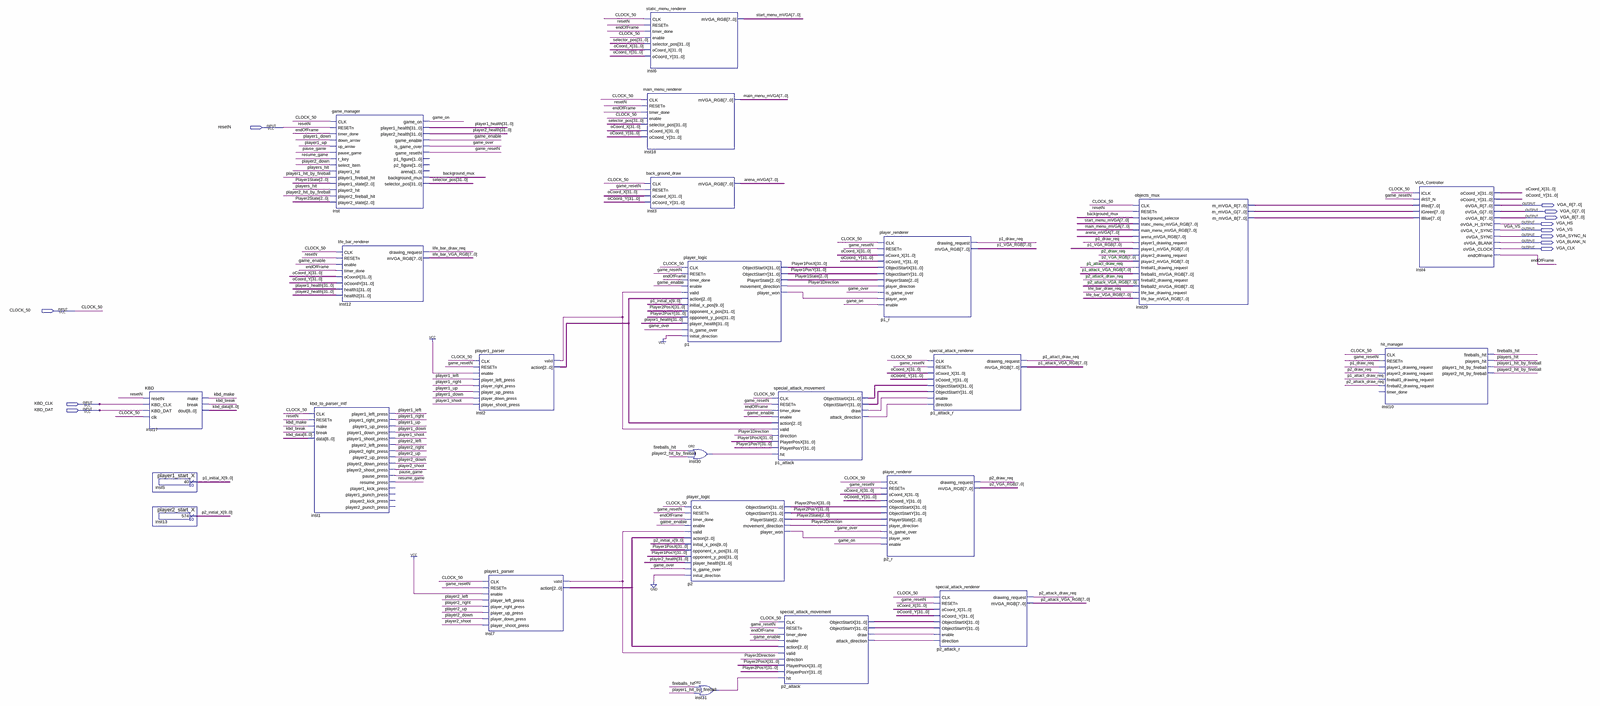
[diagram p0: schematic sheet, whole]
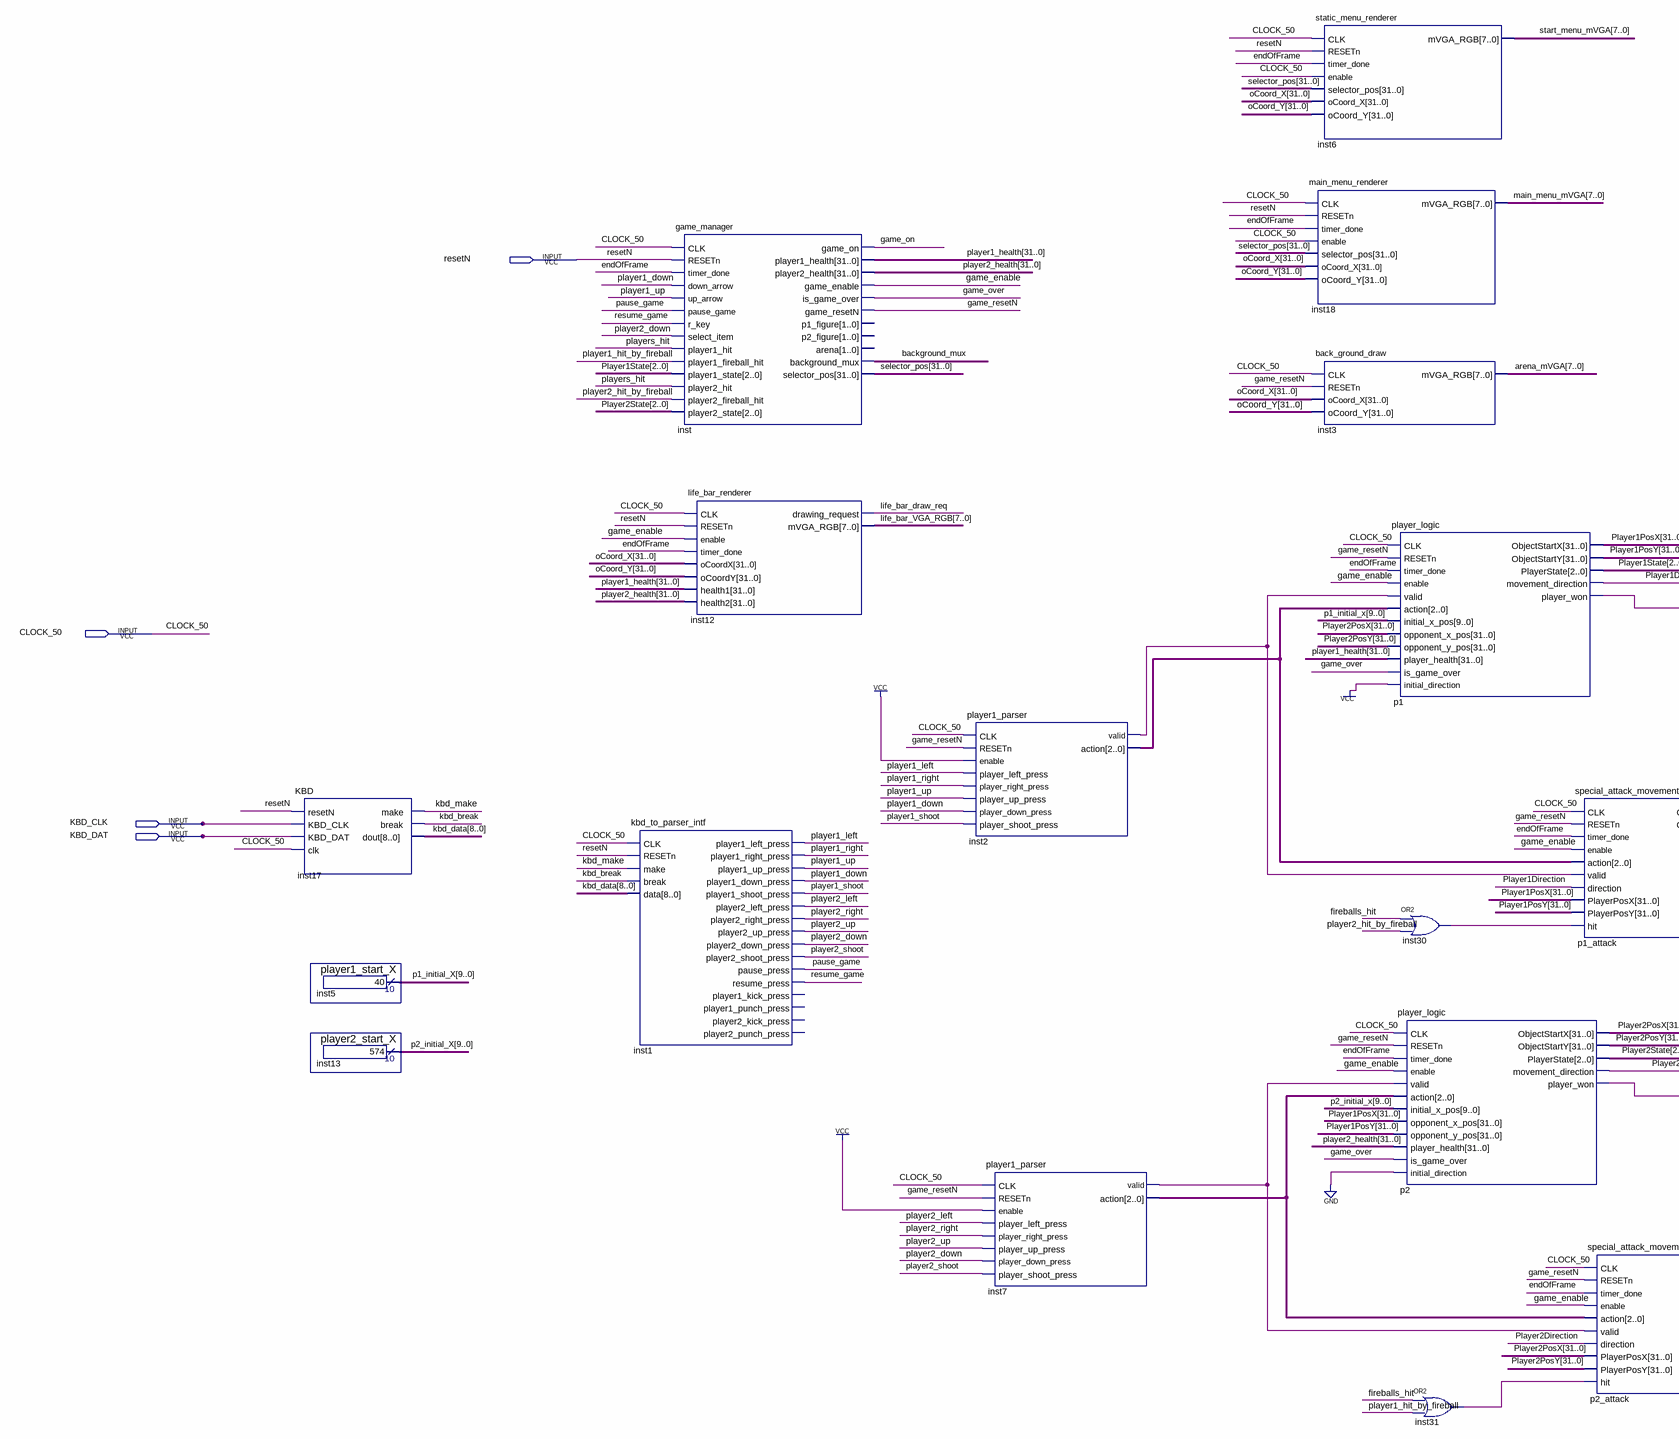
[diagram p1: schematic sheet, left part]
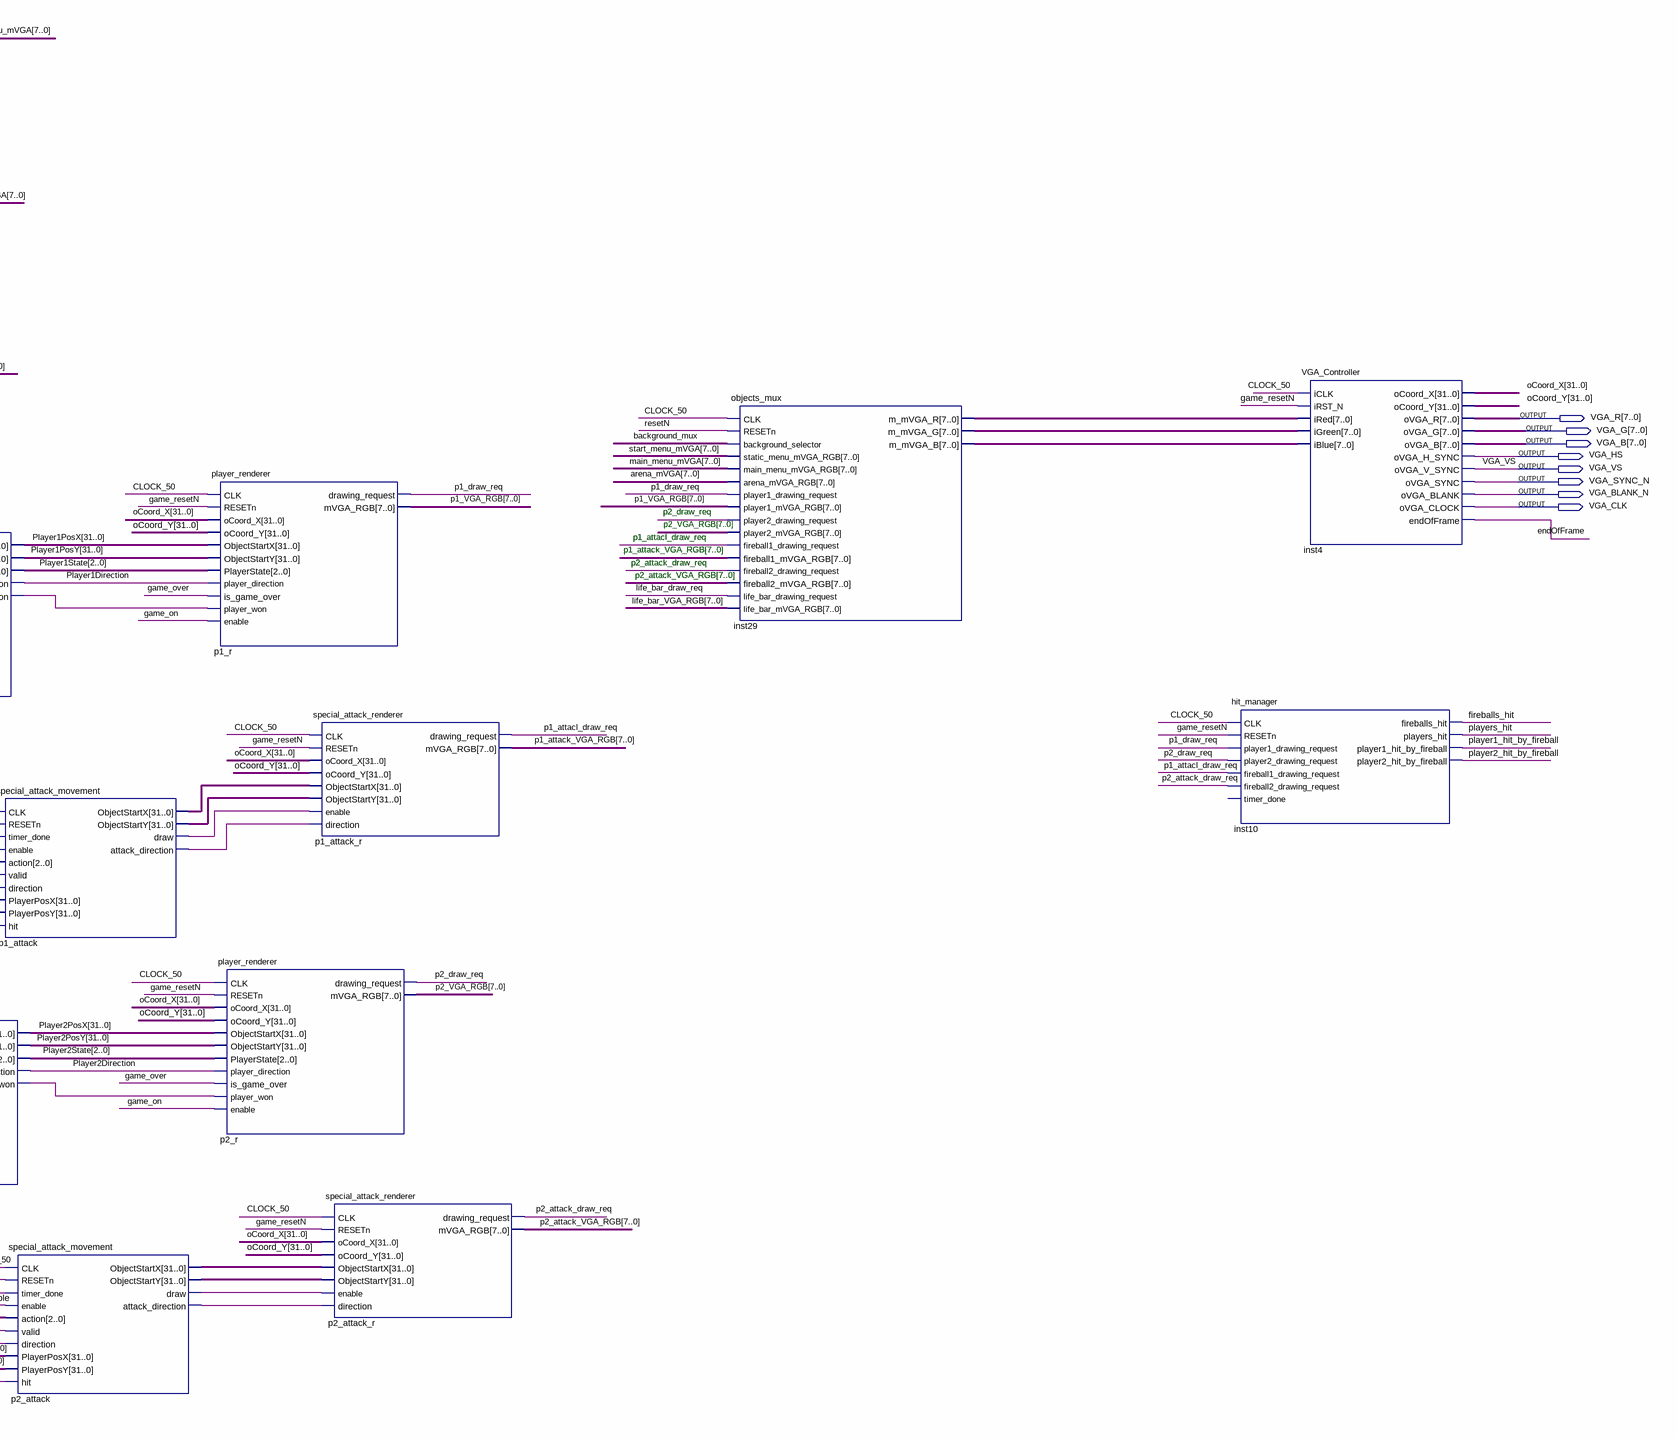
[diagram p2: schematic sheet, right part]
// Quartus schematic Test_simple.bdf as structural Verilog: 24 symbols, 12 pins
module Test_simple (
  input  resetN,
  input  CLOCK_50,
  input  KBD_CLK,
  input  KBD_DAT,
  output [7:0] VGA_R,
  output [7:0] VGA_G,
  output [7:0] VGA_B,
  output VGA_HS,
  output VGA_VS,
  output VGA_SYNC_N,
  output VGA_BLANK_N,
  output VGA_CLK
);

  wire background_mux, endOfFrame, fireballs_hit, game_enable, game_on, game_over, game_resetN, inst2_valid,
       inst7_valid, inst30_out, inst31_out, kbd_break, kbd_make, life_bar_draw_req,
       p1_attack_attack_direction, p1_attack_draw, p1_attacl_draw_req, p1_draw_req, p1_player_won,
       p2_attack_attack_direction, p2_attack_draw, p2_attack_draw_req, p2_draw_req, p2_player_won,
       pause_game, player1_down, player1_hit_by_fireball, player1_left, player1_right, player1_shoot,
       player1_up, Player1Direction, player2_down, player2_hit_by_fireball, player2_left, player2_right,
       player2_shoot, player2_up, Player2Direction, players_hit, resume_game;
  wire [2:0] inst2_action, inst7_action, Player1State, Player2State;
  wire [7:0] arena_mVGA, inst29_m_mvga_b, inst29_m_mvga_g, inst29_m_mvga_r, life_bar_VGA_RGB, main_menu_mVGA,
       p1_attack_VGA_RGB, p1_VGA_RGB, p2_attack_VGA_RGB, p2_VGA_RGB, start_menu_mVGA;
  wire [8:0] kbd_data;
  wire [9:0] p1_initial_X, p2_initial_X;
  wire [31:0] oCoord_X, oCoord_Y, p1_attack_objectstartx, p1_attack_objectstarty, p2_attack_objectstartx,
       p2_attack_objectstarty, player1_health, Player1PosX, Player1PosY, player2_health, Player2PosX,
       Player2PosY, selector_pos;

  KBD inst17 (
    .resetN(resetN), .KBD_CLK(KBD_CLK), .KBD_DAT(KBD_DAT), .clk(CLOCK_50), .make(kbd_make),
    .\break (kbd_break), .dout(kbd_data));
  player1_start_X inst5 (.result(p1_initial_X));
  player2_start_X inst13 (.result(p2_initial_X));
  kbd_to_parser_intf inst1 (
    .CLK(CLOCK_50), .RESETn(resetN), .make(kbd_make), .\break (kbd_break), .data(kbd_data),
    .player1_left_press(player1_left), .player1_right_press(player1_right), .player1_up_press(player1_up),
    .player1_down_press(player1_down), .player1_shoot_press(player1_shoot),
    .player2_left_press(player2_left), .player2_right_press(player2_right), .player2_up_press(player2_up),
    .player2_down_press(player2_down), .player2_shoot_press(player2_shoot), .pause_press(pause_game),
    .resume_press(resume_game));  // open: player1_kick_press, player1_punch_press, player2_kick_press, player2_punch_press
  game_manager inst (
    .CLK(CLOCK_50), .RESETn(resetN), .timer_done(endOfFrame), .down_arrow(player1_down),
    .up_arrow(player1_up), .pause_game(pause_game), .r_key(resume_game), .select_item(player2_down),
    .player1_hit(players_hit), .player1_fireball_hit(player1_hit_by_fireball), .player1_state(Player1State),
    .player2_hit(players_hit), .player2_fireball_hit(player2_hit_by_fireball), .player2_state(Player2State),
    .game_on(game_on), .player1_health(player1_health), .player2_health(player2_health),
    .game_enable(game_enable), .is_game_over(game_over), .game_resetN(game_resetN),
    .background_mux(background_mux), .selector_pos(selector_pos));  // open: p1_figure, p2_figure, arena
  life_bar_renderer inst12 (
    .CLK(CLOCK_50), .RESETn(resetN), .enable(game_enable), .timer_done(endOfFrame), .oCoordX(oCoord_X),
    .oCoordY(oCoord_Y), .health1(player1_health), .health2(player2_health),
    .drawing_request(life_bar_draw_req), .mVGA_RGB(life_bar_VGA_RGB));
  player1_parser inst2 (
    .CLK(CLOCK_50), .RESETn(game_resetN), .enable(1'b1), .player_left_press(player1_left),
    .player_right_press(player1_right), .player_up_press(player1_up), .player_down_press(player1_down),
    .player_shoot_press(player1_shoot), .valid(inst2_valid), .action(inst2_action));
  player1_parser inst7 (
    .CLK(CLOCK_50), .RESETn(game_resetN), .enable(1'b1), .player_left_press(player2_left),
    .player_right_press(player2_right), .player_up_press(player2_up), .player_down_press(player2_down),
    .player_shoot_press(player2_shoot), .valid(inst7_valid), .action(inst7_action));
  static_menu_renderer inst6 (
    .CLK(CLOCK_50), .RESETn(resetN), .timer_done(endOfFrame), .enable(CLOCK_50), .selector_pos(selector_pos),
    .oCoord_X(oCoord_X), .oCoord_Y(oCoord_Y), .mVGA_RGB(start_menu_mVGA));
  main_menu_renderer inst18 (
    .CLK(CLOCK_50), .RESETn(resetN), .timer_done(endOfFrame), .enable(CLOCK_50), .selector_pos(selector_pos),
    .oCoord_X(oCoord_X), .oCoord_Y(oCoord_Y), .mVGA_RGB(main_menu_mVGA));
  back_ground_draw inst3 (
    .CLK(CLOCK_50), .RESETn(game_resetN), .oCoord_X(oCoord_X), .oCoord_Y(oCoord_Y), .mVGA_RGB(arena_mVGA));
  player_logic p1 (
    .CLK(CLOCK_50), .RESETn(game_resetN), .timer_done(endOfFrame), .enable(game_enable), .valid(inst2_valid),
    .action(inst2_action), .initial_x_pos(p1_initial_X), .opponent_x_pos(Player2PosX),
    .opponent_y_pos(Player2PosY), .player_health(player1_health), .is_game_over(game_over),
    .initial_direction(1'b1), .ObjectStartX(Player1PosX), .ObjectStartY(Player1PosY),
    .PlayerState(Player1State), .movement_direction(Player1Direction), .player_won(p1_player_won));
  player_logic p2 (
    .CLK(CLOCK_50), .RESETn(game_resetN), .timer_done(endOfFrame), .enable(game_enable), .valid(inst7_valid),
    .action(inst7_action), .initial_x_pos(p2_initial_X), .opponent_x_pos(Player1PosX),
    .opponent_y_pos(Player1PosY), .player_health(player2_health), .is_game_over(game_over),
    .initial_direction(1'b0), .ObjectStartX(Player2PosX), .ObjectStartY(Player2PosY),
    .PlayerState(Player2State), .movement_direction(Player2Direction), .player_won(p2_player_won));
  or inst30 (inst30_out, fireballs_hit, player2_hit_by_fireball);
  or inst31 (inst31_out, fireballs_hit, player1_hit_by_fireball);
  special_attack_movement p1_attack (
    .CLK(CLOCK_50), .RESETn(game_resetN), .timer_done(endOfFrame), .enable(game_enable),
    .action(inst2_action), .valid(inst2_valid), .direction(Player1Direction), .PlayerPosX(Player1PosX),
    .PlayerPosY(Player1PosY), .hit(inst30_out), .ObjectStartX(p1_attack_objectstartx),
    .ObjectStartY(p1_attack_objectstarty), .draw(p1_attack_draw),
    .attack_direction(p1_attack_attack_direction));
  special_attack_movement p2_attack (
    .CLK(CLOCK_50), .RESETn(game_resetN), .timer_done(endOfFrame), .enable(game_enable),
    .action(inst7_action), .valid(inst7_valid), .direction(Player2Direction), .PlayerPosX(Player2PosX),
    .PlayerPosY(Player2PosY), .hit(inst31_out), .ObjectStartX(p2_attack_objectstartx),
    .ObjectStartY(p2_attack_objectstarty), .draw(p2_attack_draw),
    .attack_direction(p2_attack_attack_direction));
  player_renderer p1_r (
    .CLK(CLOCK_50), .RESETn(game_resetN), .oCoord_X(oCoord_X), .oCoord_Y(oCoord_Y),
    .ObjectStartX(Player1PosX), .ObjectStartY(Player1PosY), .PlayerState(Player1State),
    .player_direction(Player1Direction), .is_game_over(game_over), .player_won(p1_player_won),
    .enable(game_on), .drawing_request(p1_draw_req), .mVGA_RGB(p1_VGA_RGB));
  player_renderer p2_r (
    .CLK(CLOCK_50), .RESETn(game_resetN), .oCoord_X(oCoord_X), .oCoord_Y(oCoord_Y),
    .ObjectStartX(Player2PosX), .ObjectStartY(Player2PosY), .PlayerState(Player2State),
    .player_direction(Player2Direction), .is_game_over(game_over), .player_won(p2_player_won),
    .enable(game_on), .drawing_request(p2_draw_req), .mVGA_RGB(p2_VGA_RGB));
  special_attack_renderer p1_attack_r (
    .CLK(CLOCK_50), .RESETn(game_resetN), .oCoord_X(oCoord_X), .oCoord_Y(oCoord_Y),
    .ObjectStartX(p1_attack_objectstartx), .ObjectStartY(p1_attack_objectstarty), .enable(p1_attack_draw),
    .direction(p1_attack_attack_direction), .drawing_request(p1_attacl_draw_req), .mVGA_RGB(p1_attack_VGA_RGB));
  special_attack_renderer p2_attack_r (
    .CLK(CLOCK_50), .RESETn(game_resetN), .oCoord_X(oCoord_X), .oCoord_Y(oCoord_Y),
    .ObjectStartX(p2_attack_objectstartx), .ObjectStartY(p2_attack_objectstarty), .enable(p2_attack_draw),
    .direction(p2_attack_attack_direction), .drawing_request(p2_attack_draw_req), .mVGA_RGB(p2_attack_VGA_RGB));
  objects_mux inst29 (
    .CLK(CLOCK_50), .RESETn(resetN), .background_selector(background_mux),
    .static_menu_mVGA_RGB(start_menu_mVGA), .main_menu_mVGA_RGB(main_menu_mVGA), .arena_mVGA_RGB(arena_mVGA),
    .player1_drawing_request(p1_draw_req), .player1_mVGA_RGB(p1_VGA_RGB),
    .player2_drawing_request(p2_draw_req), .player2_mVGA_RGB(p2_VGA_RGB),
    .fireball1_drawing_request(p1_attacl_draw_req), .fireball1_mVGA_RGB(p1_attack_VGA_RGB),
    .fireball2_drawing_request(p2_attack_draw_req), .fireball2_mVGA_RGB(p2_attack_VGA_RGB),
    .life_bar_drawing_request(life_bar_draw_req), .life_bar_mVGA_RGB(life_bar_VGA_RGB),
    .m_mVGA_R(inst29_m_mvga_r), .m_mVGA_G(inst29_m_mvga_g), .m_mVGA_B(inst29_m_mvga_b));
  hit_manager inst10 (
    .CLK(CLOCK_50), .RESETn(game_resetN), .player1_drawing_request(p1_draw_req),
    .player2_drawing_request(p2_draw_req), .fireball1_drawing_request(p1_attacl_draw_req),
    .fireball2_drawing_request(p2_attack_draw_req), .fireballs_hit(fireballs_hit), .players_hit(players_hit),
    .player1_hit_by_fireball(player1_hit_by_fireball), .player2_hit_by_fireball(player2_hit_by_fireball));  // open: timer_done
  VGA_Controller inst4 (
    .iCLK(CLOCK_50), .iRST_N(game_resetN), .iRed(inst29_m_mvga_r), .iGreen(inst29_m_mvga_g),
    .iBlue(inst29_m_mvga_b), .oCoord_X(oCoord_X), .oCoord_Y(oCoord_Y), .oVGA_R(VGA_R), .oVGA_G(VGA_G),
    .oVGA_B(VGA_B), .oVGA_H_SYNC(VGA_HS), .oVGA_V_SYNC(VGA_VS), .oVGA_SYNC(VGA_SYNC_N),
    .oVGA_BLANK(VGA_BLANK_N), .oVGA_CLOCK(VGA_CLK), .endOfFrame(endOfFrame));

  // Notes on the sheet:
  //   p2_draw_req
  //   p2_VGA_RGB[7..0]
  //   p1_attacl_draw_req
  //   p1_attack_VGA_RGB[7..0]
  //   p2_attack_draw_req
  //   p2_attack_VGA_RGB[7..0]
endmodule
